# EAGLE design Rev 1 (EAGLE 5.11)
MF: PANASONIC; MPN: EEEFK1E101P; OC_FARNELL: 9695770
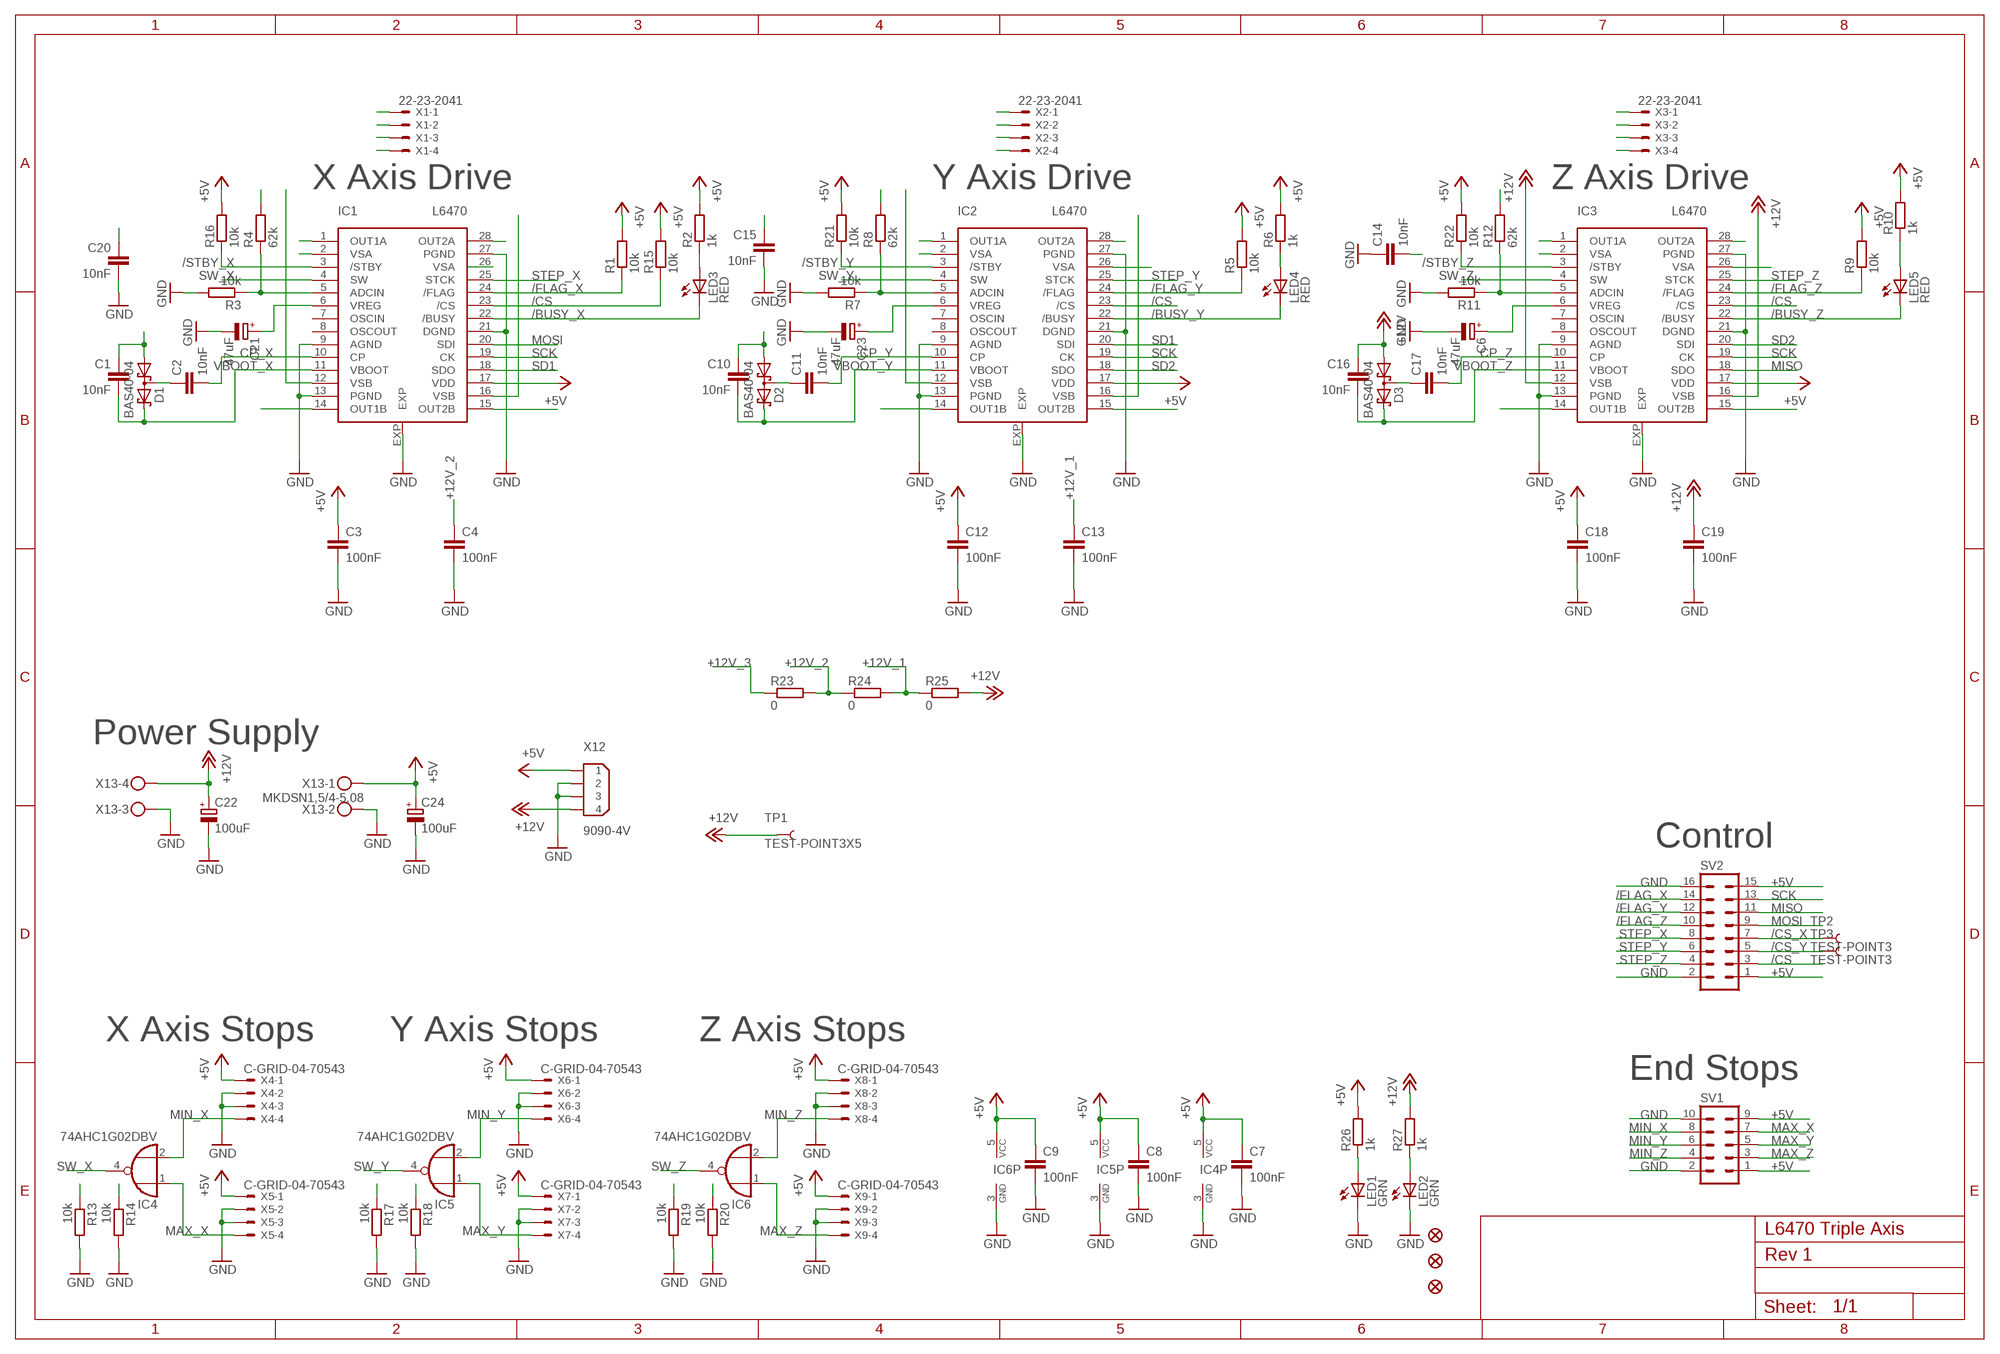
[diagram p0: schematic, sheet 1]

## Parts
C1  10nF  C-EUC0603  [C0603]
C2  10nF  C-EUC0603  [C0603]
C3  100nF  C-EUC0603  [C0603]
C4  100nF  C-EUC0603  [C0603]
C6  47uF  CPOL-EUB  [PANASONIC_B]
C7  100nF  C-EUC0603  [C0603]
C8  100nF  C-EUC0603  [C0603]
C9  100nF  C-EUC0603  [C0603]
C10  10nF  C-EUC0603  [C0603]
C11  10nF  C-EUC0603  [C0603]
C12  100nF  C-EUC0603  [C0603]
C13  100nF  C-EUC0603  [C0603]
C14  10nF  C-EUC0603  [C0603]
C15  10nF  C-EUC0603  [C0603]
C16  10nF  C-EUC0603  [C0603]
C17  10nF  C-EUC0603  [C0603]
C18  100nF  C-EUC0603  [C0603]
C19  100nF  C-EUC0603  [C0603]
C20  10nF  C-EUC0603  [C0603]
C21  47uF  CPOL-EUB  [PANASONIC_B]
C22  100uF  CPOL-EUE  [PANASONIC_E]
C23  47uF  CPOL-EUB  [PANASONIC_B]
C24  100uF  CPOL-EUE  [PANASONIC_E]
D1  BAS40-04  [SOT23]
D2  BAS40-04  [SOT23]
D3  BAS40-04  [SOT23]
FID1  FIDUCIAL1X2.5  [FIDUCIAL-1X2.5]
FID2  FIDUCIAL1X2.5  [FIDUCIAL-1X2.5]
FID3  FIDUCIAL1X2.5  [FIDUCIAL-1X2.5]
IC1  L6470  [TSSOP28]
IC2  L6470  [TSSOP28]
IC3  L6470  [TSSOP28]
IC4  74AHC1G02DBV  [SOT23-5]
IC5  74AHC1G02DBV  [SOT23-5]
IC6  74AHC1G02DBV  [SOT23-5]
LED1  GRN  LEDCHIP-LED0603  [CHIP-LED0603]
LED2  GRN  LEDCHIP-LED0603  [CHIP-LED0603]
LED3  RED  LEDCHIP-LED0603  [CHIP-LED0603]
LED4  RED  LEDCHIP-LED0603  [CHIP-LED0603]
LED5  RED  LEDCHIP-LED0603  [CHIP-LED0603]
R1  10k  R-EU_R0603  [R0603]
R2  1k  R-EU_R0603  [R0603]
R3  10k  R-EU_R0603  [R0603]
R4  62k  R-EU_R0603  [R0603]
R5  10k  R-EU_R0603  [R0603]
R6  1k  R-EU_R0603  [R0603]
R7  10k  R-EU_R0603  [R0603]
R8  62k  R-EU_R0603  [R0603]
R9  10k  R-EU_R0603  [R0603]
R10  1k  R-EU_R0603  [R0603]
R11  10k  R-EU_R0603  [R0603]
R12  62k  R-EU_R0603  [R0603]
R13  10k  R-EU_R0603  [R0603]
R14  10k  R-EU_R0603  [R0603]
R15  10k  R-EU_R0603  [R0603]
R16  10k  R-EU_R0603  [R0603]
R17  10k  R-EU_R0603  [R0603]
R18  10k  R-EU_R0603  [R0603]
R19  10k  R-EU_R0603  [R0603]
R20  10k  R-EU_R0603  [R0603]
R21  10k  R-EU_R0603  [R0603]
R22  10k  R-EU_R0603  [R0603]
R23  0  R-EU_0204/7  [0204/7]
R24  0  R-EU_0204/7  [0204/7]
R25  0  R-EU_0204/7  [0204/7]
R26  1k  R-EU_R0603  [R0603]
R27  1k  R-EU_R0603  [R0603]
SV1  ML10  [ML10]
SV2  ML16  [ML16]
TP1  TEST-POINT3X5  [PAD.03X.05]
TP2  TEST-POINT3  [PAD.03X.03]
TP3  TEST-POINT3  [PAD.03X.03]
X1  22-23-2041  [22-23-2041]
X2  22-23-2041  [22-23-2041]
X3  22-23-2041  [22-23-2041]
X4  C-GRID-04-70543  [70543-04]
X5  C-GRID-04-70543  [70543-04]
X6  C-GRID-04-70543  [70543-04]
X7  C-GRID-04-70543  [70543-04]
X8  C-GRID-04-70543  [70543-04]
X9  C-GRID-04-70543  [70543-04]
X12  9090-4V  [9090-4V]
X13  MKDSN1,5/4-5,08  [MKDSN1,5/4-5,08]

## Nets
+5V [5_V]: C3.1 C7.1 C8.1 C9.1 C12.1 C18.1 C24.+ IC1.17(VDD) IC2.17(VDD) IC3.17(VDD) IC4.5(VCC) IC5.5(VCC) IC6.5(VCC) R1.2 R2.2 R5.2 R6.2 R9.2 R10.2 R15.2 R16.2 R21.2 R22.2 R26.2 SV1.1 SV1.9 SV2.1 SV2.15 X4.1 X5.1 X6.1 X7.1 X8.1 X9.1 X12.1 X13.1
+12V [12_V]: C16.1 C19.1 C22.+ D3.1(A1) IC3.12(VSB) IC3.16(VSB) R25.2 R27.2 TP1.P$1 X12.4 X13.4
+12V_1 [12_V]: C10.1 C13.1 D2.1(A1) IC2.12(VSB) IC2.16(VSB) IC3.2(VSA) IC3.26(VSA) R12.2 R24.2 R25.1
+12V_2: C1.1 C4.1 D1.1(A1) IC1.12(VSB) IC1.16(VSB) IC2.2(VSA) IC2.26(VSA) R8.2 R23.2 R24.1
+12V_3: IC1.2(VSA) IC1.26(VSA) R4.2 R23.1
/BUSY_X: IC1.22(/BUSY) LED3.C
/BUSY_Y: IC2.22(/BUSY) LED4.C
/BUSY_Z: IC3.22(/BUSY) LED5.C
/CS: IC1.23(/CS) IC2.23(/CS) IC3.23(/CS) R15.1 SV2.3
/CS_X: SV2.7 TP2.P$1
/CS_Y: SV2.5 TP3.P$1
/FLAG_X: IC1.24(/FLAG) R1.1 SV2.14
/FLAG_Y: IC2.24(/FLAG) R5.1 SV2.12
/FLAG_Z: IC3.24(/FLAG) R9.1 SV2.10
/STBY_X: IC1.3(/STBY) R16.1
/STBY_Y: IC2.3(/STBY) R21.1
/STBY_Z: IC3.3(/STBY) R22.1
ADC_X: C20.1 IC1.5(ADCIN) R3.1 R4.1
ADC_Y: C15.1 IC2.5(ADCIN) R7.1 R8.1
ADC_Z: C14.2 IC3.5(ADCIN) R11.1 R12.1
CP_X: C2.2 IC1.10(CP)
CP_Y: C11.2 IC2.10(CP)
CP_Z: C17.2 IC3.10(CP)
GND: C3.2 C4.2 C6.- C7.2 C8.2 C9.2 C12.2 C13.2 C14.1 C15.2 C18.2 C19.2 C20.2 C21.- C22.- C23.- C24.- IC1.9(AGND) IC1.13(PGND) IC1.21(DGND) IC1.27(PGND) IC1.EXP IC2.9(AGND) IC2.13(PGND) IC2.21(DGND) IC2.27(PGND) IC2.EXP IC3.9(AGND) IC3.13(PGND) IC3.21(DGND) IC3.27(PGND) IC3.EXP IC4.3(GND) IC5.3(GND) IC6.3(GND) LED1.C LED2.C R3.2 R7.2 R11.2 R13.2 R14.2 R17.2 R18.2 R19.2 R20.2 SV1.2 SV1.10 SV2.2 SV2.16 X4.2 X4.3 X5.2 X5.3 X6.2 X6.3 X7.2 X7.3 X8.2 X8.3 X9.2 X9.3 X12.2 X12.3 X13.2 X13.3
MAX_X: IC4.1(I0) R14.1 SV1.7 X5.4
MAX_Y: IC5.1(I0) R18.1 SV1.5 X7.4
MAX_Z: IC6.1(I0) R20.1 SV1.3 X9.4
MIN_X: IC4.2(I1) R13.1 SV1.8 X4.4
MIN_Y: IC5.2(I1) R17.1 SV1.6 X6.4
MIN_Z: IC6.2(I1) R19.1 SV1.4 X8.4
MISO: IC3.18(SDO) SV2.11
MOSI: IC1.20(SDI) SV2.9
N$1: C17.1 D3.3(C1A2)
N$3: C2.1 D1.3(C1A2)
N$4: IC3.1(OUT1A) X3.4
N$5: IC3.28(OUT2A) X3.3
N$6: IC3.15(OUT2B) X3.2
N$7: IC3.14(OUT1B) X3.1
N$8 [12_V]: IC1.15(OUT2B) X1.2
N$10: C21.+ IC1.6(VREG)
N$11 [12_V]: IC1.1(OUT1A) X1.4
N$12 [12_V]: IC1.28(OUT2A) X1.3
N$13 [12_V]: IC2.28(OUT2A) X2.3
N$14 [12_V]: IC2.1(OUT1A) X2.4
N$15: C11.1 D2.3(C1A2)
N$17: LED1.A R26.1
N$18: LED2.A R27.1
N$19 [12_V]: IC2.15(OUT2B) X2.2
N$20 [12_V]: IC2.14(OUT1B) X2.1
N$22: LED3.A R2.1
N$23: LED4.A R6.1
N$25 [12_V]: IC1.14(OUT1B) X1.1
N$26: LED5.A R10.1
N$27: C6.+ IC3.6(VREG)
N$29: C23.+ IC2.6(VREG)
SCK: IC1.19(CK) IC2.19(CK) IC3.19(CK) SV2.13
SD1: IC1.18(SDO) IC2.20(SDI)
SD2: IC2.18(SDO) IC3.20(SDI)
STEP_X: IC1.25(STCK) SV2.8
STEP_Y: IC2.25(STCK) SV2.6
STEP_Z: IC3.25(STCK) SV2.4
SW_X: IC1.4(SW) IC4.4(O)
SW_Y: IC2.4(SW) IC5.4(O)
SW_Z: IC3.4(SW) IC6.4(O)
VBOOT_X: C1.2 D1.2(C2) IC1.11(VBOOT)
VBOOT_Y: C10.2 D2.2(C2) IC2.11(VBOOT)
VBOOT_Z: C16.2 D3.2(C2) IC3.11(VBOOT)
Unconnected: IC1.7(OSCIN) IC1.8(OSCOUT) IC2.7(OSCIN) IC2.8(OSCOUT) IC3.7(OSCIN) IC3.8(OSCOUT)

## Notes on the sheet
- X Axis Drive | Y Axis Drive | Z Axis Drive
- Power Supply
- Control
- X Axis Stops | Y Axis Stops | Z Axis Stops
- End Stops
- L6470 Triple Axis

## Library data of the parts
C1-C4 C7-C20 = rcl:C-EU: CAPACITOR, European symbol
C6 C21-C24 = rcl:CPOL-EU: POLARIZED CAPACITOR, European symbol
D1-D3 = diode:BAS40-04: Silicon Schottky Diodes General-purpose diode for high-speed switching
FID1-FID3 = microbuilder:FIDUCIAL: Fiducial Alignment Points Various fiducial points for machine vision alignment.
IC1-IC3 = general:L6470: The L6470, realized in analog mixed signal technology, is an advanced fully integrated solution suitable for driving two phase bipolar stepper motors with microstepping. It integrates a dual low RDSon DMOS full bridge with all of the power switches equipped with an accurate on chip current sensing circuitry suitable for non dissipative current control and overcurrent protections. Thanks to a unique control system a true 1/128 steps resolution is achieved. The digital control core can generate user defined motion profiles with acceleration, deceleration, speed or target position easily programmed through a dedicated registers set. All commands and data registers, including those used to set analogue values (i.e. current control value, current protection trip point, dead time, PWM frequency etc.) are sent through a standard 5Mbit/s SPI. A very rich set of protections (thermal, low bus voltage, overcurrent, motor stall) allows designing a fully protected application, as required by most demanding motor control applications.
IC4-IC6 = 74xx-little-de:74*1G02: 2-input NOR gate
LED1-LED5 = led:LED: LED OSRAM: - CHIPLED LG R971, LG N971, LY N971, LG Q971, LY Q971, LO R971, LY R971 LH N974, LH R974 LS Q976, LO Q976, LY Q976 LO Q996 - Hyper CHIPLED LW Q18S LB Q993, LB Q99A, LB R99A - SideLED LS A670, LO A670, LY A670, LG A670, LP A670 LB A673, LV A673, LT A673, LW A673 LH A674 LY A675 LS A676, LA A676, LO A676, LY A676, LW A676 LS A679, LY A679, LG A679 - Hyper Micro SIDELED® LS Y876, LA Y876, LO Y876, LY Y876 LT Y87S - SmartLED LW L88C, LW L88S LB L89C, LB L89S, LG L890 LS L89K, LO L89K, LY L89K LS L896, LA L896, LO L896, LY L896 - TOPLED LS T670, LO T670, LY T670, LG T670, LP T670 LSG T670, LSP T670, LSY T670, LOP T670, LYG T670 LG T671, LOG T671, LSG T671 LB T673, LV T673, LT T673, LW T673 LH T674 LS T676, LA T676, LO T676, LY T676, LB T676, LH T676, LSB T676, LW T676 LB T67C, LV T67C, LT T67C, LS T67K, LO T67K, LY T67K, LW E67C LS E67B, LA E67B, LO E67B, LY E67B, LB E67C, LV E67C, LT E67C LW T67C LS T679, LY T679, LG T679 LS T770, LO T770, LY T770, LG T770, LP T770 LB T773, LV T773, LT T773, LW T773 LH T774 LS E675, LA E675, LY E675, LS T675 LS T776, LA T776, LO T776, LY T776, LB T776 LHGB T686 LT T68C, LB T68C - Hyper Mini TOPLED® LB M676 - Mini TOPLED Santana® LG M470 LS M47K, LO M47K, LY M47K Source: http://www.osram.convergy.de LUXEON: - LUMILED® LXK2-PW12-R00, LXK2-PW12-S00, LXK2-PW14-U00, LXK2-PW14-V00 LXK2-PM12-R00, LXK2-PM12-S00, LXK2-PM14-U00 LXK2-PE12-Q00, LXK2-PE12-R00, LXK2-PE12-S00, LXK2-PE14-T00, LXK2-PE14-U00 LXK2-PB12-K00, LXK2-PB12-L00, LXK2-PB12-M00, LXK2-PB14-N00, LXK2-PB14-P00, LXK2-PB14-Q00 LXK2-PR12-L00, LXK2-PR12-M00, LXK2-PR14-Q00, LXK2-PR14-R00 LXK2-PD12-Q00, LXK2-PD12-R00, LXK2-PD12-S00 LXK2-PH12-R00, LXK2-PH12-S00 LXK2-PL12-P00, LXK2-PL12-Q00, LXK2-PL12-R00 Source: www.luxeon.com KINGBRIGHT: KA-3528ASYC Source: www.kingbright.com
R1-R27 = rcl:R-EU_: RESISTOR, European symbol
SV1 = con-harting-ml:ML10: HARTING
SV2 = con-ml:ML16: HARTING
TP1-TP3 = SparkFun:TEST-POINT
X1-X3 = con-molex:22-23-2041: .100" (2.54mm) Center Header - 4 Pin
X4-X9 = con-molex:C-GRID-04: CONNECTOR wire to board 2.54 mm (0.100") pitch header
X12 = con-thomas-betts:9090-4: Disk Drive Power four position Source: Thomas & Betts Electronic Interconnects Eiropean Edition 1998
X13 = con-phoenix-508:MKDSN1,5/4-5,08: MKDSN 1,5/ 4-5,08 Printklemme Nennstrom: 13,5 A Nennspannung: 250 V Rastermaß: 5,08 mm Polzahl: 4 Anschlussart: Schraubanschluss Montage: Löten Anschlussrichtung Leiter/Platine: 0 ° Artikelnummer: 1729144 Source: http://eshop.phoenixcontact.com .. 1729144.pdf

## Net classes
0 default: drill 0.33 mm, clearance 0.203 mm
1 12_V: width 0.406 mm, drill 0.33 mm, clearance 0.203 mm
2 5_V: width 0.305 mm, drill 0.33 mm, clearance 0.203 mm

## Board
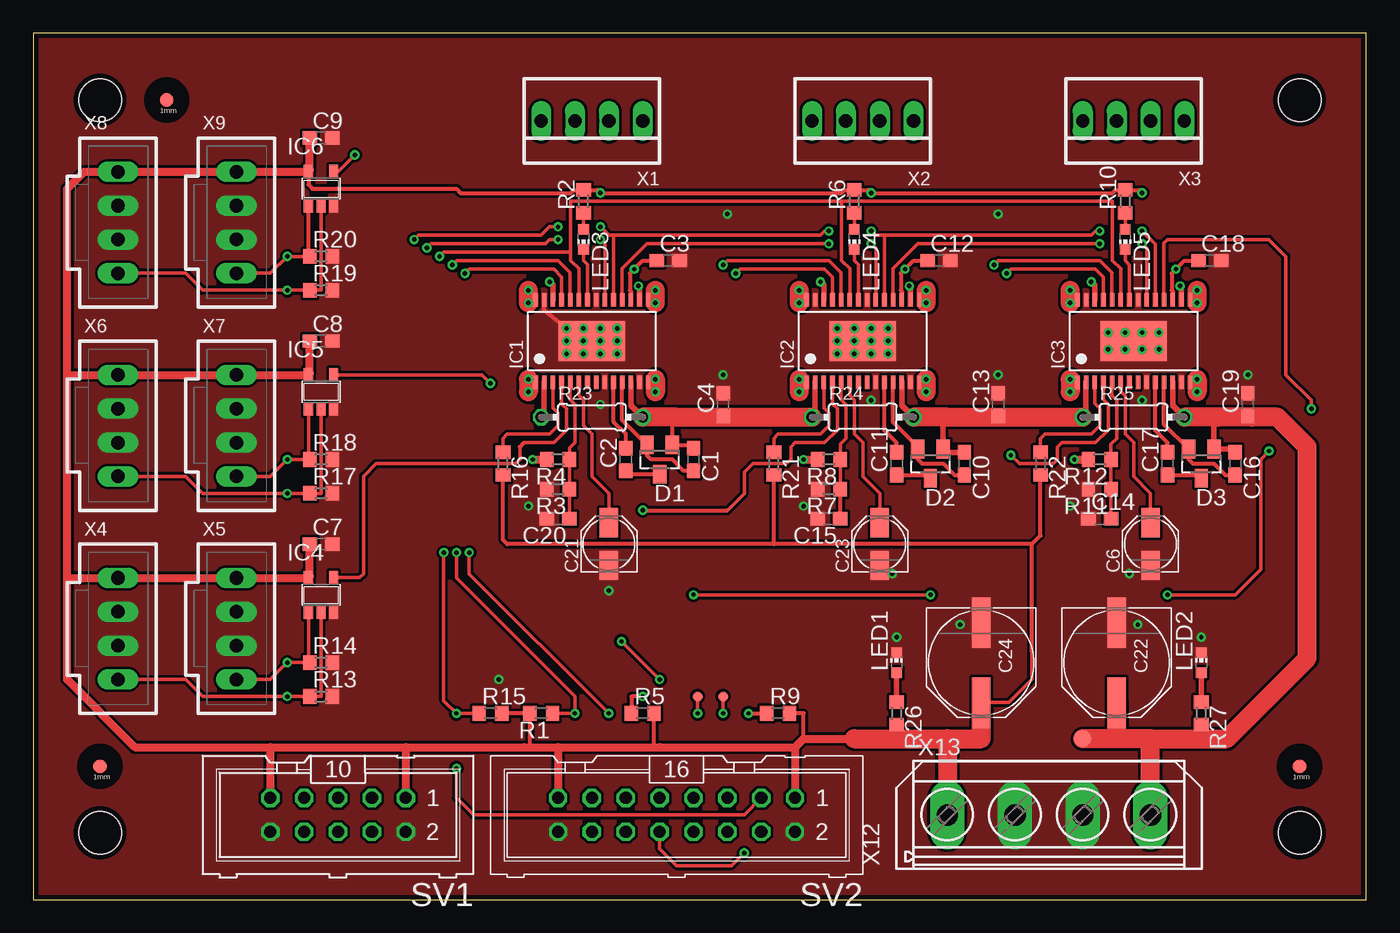
[diagram p1: board, top side]
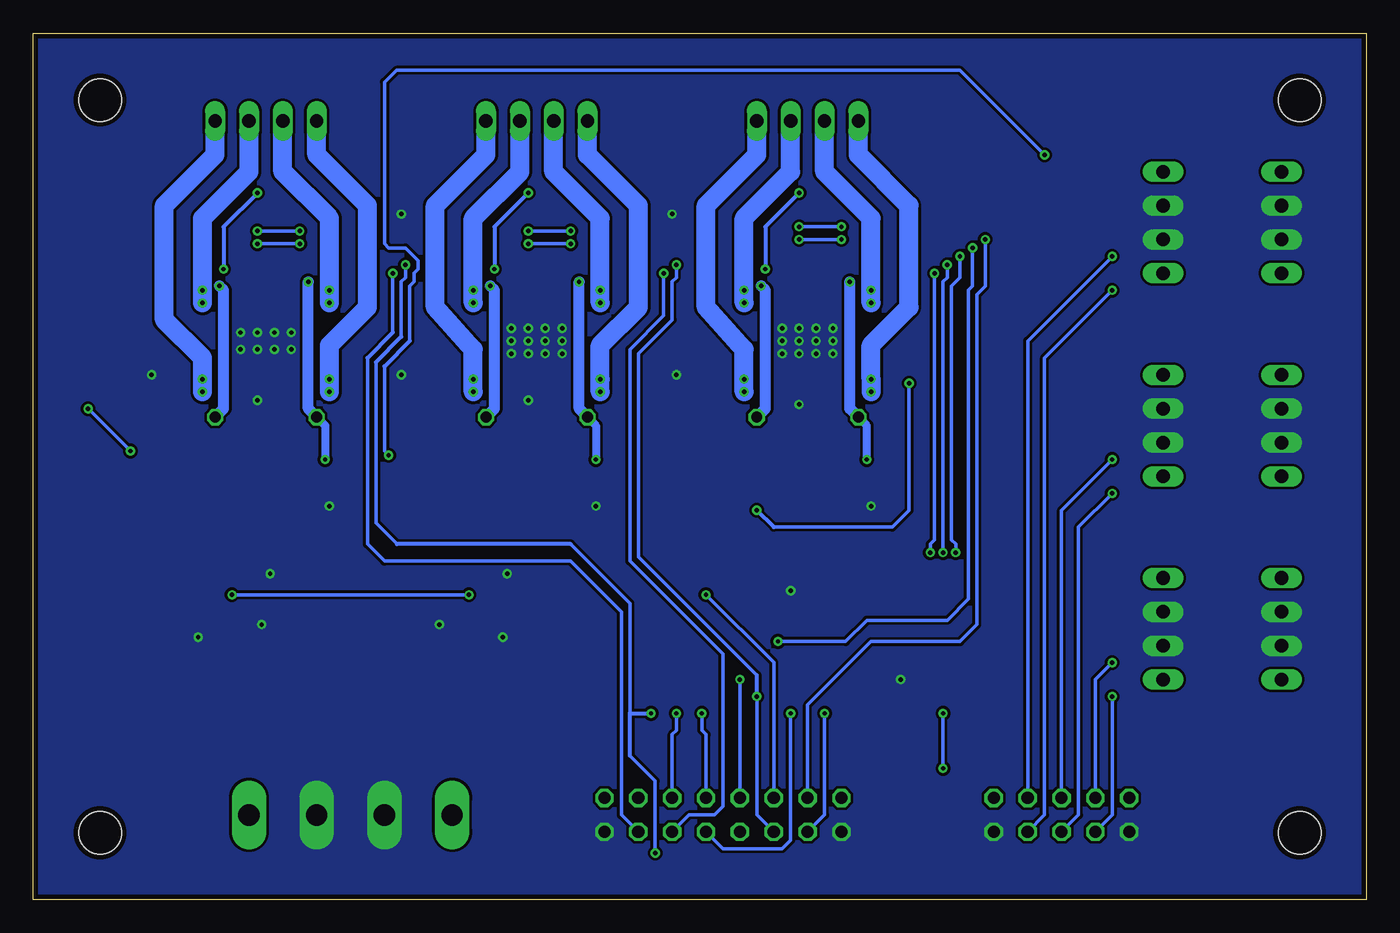
[diagram p2: board, bottom side, seen from below]

Size 100 x 65 mm. Coordinates in mm from the lower left corner, seen from the top.
Outline: 0,0 100,0 100,65 0,65 0,0
Copper layers (1*16): Top 0.0356mm / dielectric 1.5011mm / Bottom 0.0356mm
Design rules "LaenPCBOrder": minimum track width 6mil, minimum drill 13mil, track to track 6mil, track to pad 6mil, pad to pad 6mil, via to via 6mil, smd to smd 6mil, copper to edge 15mil, drill to drill 6mil, minimum pad ring 7mil, minimum via ring 7mil, stop-mask expansion 4mil, vias tented up to drill 0mil, thermal gap 10mil
Holes 3.2 mm at 5,60 5,5 95,5 95,60

### Footprints (pad centres in the part's own frame; a part is rotated, then mirrored left to right if it is on the bottom)
C0603 = smd 1.1 x 1: 1 -0.85,0; 2 0.85,0
PANASONIC_B = smd 2.2 x 1.4: + 1.6,0; - -1.6,0
PANASONIC_E = smd 3.8 x 1.4: + 3,0; - -3,0
SOT23 = smd 1 x 1.4: 1 -0.95,-1.1; 2 0.95,-1.1; 3 0,1.1
FIDUCIAL-1X2.5 = smd 1 x 1: 1 0,0
TSSOP28 = smd 0.35 x 1: 1 -4.225,-3.087; 2 -3.575,-3.087; 3 -2.925,-3.087; 4 -2.275,-3.087; 5 -1.625,-3.087; 6 -0.975,-3.087; 7 -0.325,-3.087; 8 0.325,-3.087; 9 0.975,-3.087; 10 1.625,-3.087; 11 2.275,-3.087; 12 2.925,-3.087; 13 3.575,-3.087; 14 4.225,-3.087; 15 4.225,3.087; 16 3.575,3.087; 17 2.925,3.087; 18 2.275,3.087; 19 1.625,3.087; 20 0.975,3.087; 21 0.325,3.087; 22 -0.325,3.087; 23 -0.975,3.087; 24 -1.625,3.087; 25 -2.275,3.087; 26 -2.925,3.087; 27 -3.575,3.087; 28 -4.225,3.087 | smd 5 x 3: EXP 0,0
SOT23-5 = smd 0.69 x 0.99: 1 -0.95,-1.29; 2 0,-1.29; 3 0.95,-1.29; 4 0.95,1.3; 5 -0.95,1.3
CHIP-LED0603 = smd 0.8 x 0.8: A 0,-0.75; C 0,0.75
R0603 = smd 1 x 1.1: 1 -0.85,0; 2 0.85,0
0204/7 = drill 0.813 octagon: 1 -3.81,0; 2 3.81,0
ML10 = drill 0.914 octagon: 1 -5.08,-1.27; 2 -5.08,1.27; 3 -2.54,-1.27; 4 -2.54,1.27; 5 0,-1.27; 6 0,1.27; 7 2.54,-1.27; 8 2.54,1.27; 9 5.08,-1.27; 10 5.08,1.27
ML16 = drill 0.914 octagon: 1 -8.89,-1.27; 2 -8.89,1.27; 3 -6.35,-1.27; 4 -6.35,1.27; 5 -3.81,-1.27; 6 -3.81,1.27; 7 -1.27,-1.27; 8 -1.27,1.27; 9 1.27,-1.27; 10 1.27,1.27; 11 3.81,-1.27; 12 3.81,1.27; 13 6.35,-1.27; 14 6.35,1.27; 15 8.89,-1.27; 16 8.89,1.27
PAD.03X.05 = smd 1.27 x 1.27: P$1 0,0
PAD.03X.03 = smd 0.762 x 0.762: P$1 0,0
22-23-2041 = drill 1 long: 1 -3.81,0; 2 -1.27,0; 3 1.27,0; 4 3.81,0
70543-04 = drill 1.016 long: 1 -3.81,0; 2 -1.27,0; 3 1.27,0; 4 3.81,0
9090-4V = drill 1.6 pad 2.6 long: 1 -7.62,0; 2 -2.54,0; 3 2.54,0; 4 7.62,0
MKDSN1,5/4-5,08 = drill 1.3 pad 2 round: 1 -7.641,0.025; 2 -2.561,0.025; 3 2.519,0.025; 4 7.599,0.025

### Placement (x,y rotation side)
C1  49.53,33.02 270 top
C2  44.45,33.02 90 top
C3  47.62,47.94 0 top
C4  51.75,37.15 90 top
C6  83.82,26.67 90 top
C7  21.59,26.67 0 top
C8  21.59,41.91 0 top
C9  21.59,57.15 0 top
C10  69.85,32.7 270 top
C11  64.77,32.7 90 top
C12  67.94,47.94 0 top
C13  72.39,37.15 90 top
C14  80.01,28.57 0 top
C15  59.69,28.57 180 top
C16  90.17,32.7 270 top
C17  85.09,32.7 90 top
C18  88.27,47.94 0 top
C19  91.12,37.15 90 top
C20  39.37,28.57 180 top
C21  43.18,26.67 90 top
C22  81.28,17.78 270 top
C23  63.5,26.67 90 top
C24  71.12,17.78 270 top
D1  46.99,33.02 180 top
D2  67.31,32.7 180 top
D3  87.63,32.7 180 top
FID1  5,10 0 top
FID2  95,10 0 top
FID3  10,60 0 top
IC1  41.91,41.91 0 top
IC2  62.23,41.91 0 top
IC3  82.55,41.91 0 top
IC4  21.59,22.86 0 top
IC5  21.59,38.1 0 top
IC6  21.59,53.34 0 top
LED1  64.77,17.78 0 top
LED2  87.63,17.78 0 top
LED3  41.27,49.53 180 top
LED4  61.59,49.53 180 top
LED5  81.92,49.53 180 top
R1  38.1,13.97 180 top
R2  41.27,52.39 90 top
R3  39.37,30.8 180 top
R4  39.37,33.02 180 top
R5  45.72,13.97 0 top
R6  61.59,52.39 90 top
R7  59.69,30.8 180 top
R8  59.69,33.02 180 top
R9  55.88,13.97 0 top
R10  81.92,52.39 90 top
R11  80.01,30.8 180 top
R12  80.01,33.02 180 top
R13  21.59,15.24 0 top
R14  21.59,17.78 0 top
R15  34.29,13.97 0 top
R16  35.24,32.7 270 top
R17  21.59,30.48 0 top
R18  21.59,33.02 0 top
R19  21.59,45.72 0 top
R20  21.59,48.26 0 top
R21  55.56,32.7 270 top
R22  75.56,32.7 270 top
R23  41.91,36.2 0 top
R24  62.23,36.2 0 top
R25  82.55,36.2 0 top
R26  64.77,13.97 270 top
R27  87.63,13.97 270 top
SV1  22.86,6.35 180 top
SV2  48.26,6.35 180 top
TP1  78.74,12.06 0 top
TP2  49.85,15.24 0 top
TP3  51.75,15.24 90 top
X1  41.91,58.42 180 top
X2  62.23,58.42 180 top
X3  82.55,58.42 180 top
X4  6.35,20.32 270 top
X5  15.24,20.32 270 top
X6  6.35,35.56 270 top
X7  15.24,35.56 270 top
X8  6.35,50.8 270 top
X9  15.24,50.8 270 top
X12  76.2,6.35 0 top
X13  76.2,6.35 0 top

### Tracks (layer width: path | path; a pad name or v marks a point on that pad's centre or on a via)
+5V  (via drill 0.33)
  Top 0: X12.1 X13.1
  Top 0.254: C24.+ 73.2,14.78 74.93,16.51 74.93,18.59
  Top 0.305: 20.61,24.13 IC4.5 20.74,24.26 | 20.61,39.37 IC5.5 20.74,39.5 | 20.61,54.61 IC6.5 | IC6.5 20.74,54.74 | R16.2 35.24,26.99 35.56,26.67 55.56,26.67 | 55.56,26.67 R21.2 | R22.2 75.56,27.3 74.93,26.67 | 74.93,26.67 55.56,26.67 | IC1.17 44.84,45.65 44.77,45.72 44.77,46.99 v45.09,47.31 45.72,47.94 C3.1 | IC2.17 65.16,45.65 65.09,45.72 65.09,46.99 v65.41,47.31 66.04,47.94 C12.1 | IC3.17 85.47,45.65 85.41,45.72 85.41,46.99 v85.72,47.31 86.36,47.94 C18.1 | 74.93,18.59 74.93,26.67 | 36.83,11.43 37.25,11.43 R1.2 R15.2 | R5.2 46.57,11.43 46.99,11.43 | R9.2 57.78,13.97 57.78,12.06 | v83.19,53.02 82.97,53.24 R10.2 81.18,53.24 80.96,53.02 v62.87,53.02 62.65,53.24 R6.2 60.86,53.24 60.64,53.02 v42.55,53.02 42.33,53.24 R2.2 40.54,53.24 40.32,53.02 32.07,53.02 31.75,53.34 20.95,53.34 20.64,53.66 IC6.5
  Top 0.406: 68.58,6.4 X13.1
  Top 0.61: 2.54,24.13 2.54,39.37 | 2.54,39.37 2.54,53.34 3.81,54.61 X8.1 X9.1 20.61,54.61 | 2.54,24.13 X4.1 X5.1 20.61,24.13 | 2.54,39.37 X6.1 X7.1 20.61,39.37 | 2.54,24.13 2.54,16.51 7.62,11.43 17.78,11.43 | 17.78,11.43 SV1.9 | 17.78,11.43 27.94,11.43 | 27.94,11.43 36.83,11.43 39.37,11.43 | 39.37,11.43 46.99,11.43 57.15,11.43 | 27.94,11.43 SV1.1 | 20.74,39.5 C8.1 | 20.74,24.26 C7.1 | 20.74,54.74 C9.1 | 57.15,11.43 SV2.1 | 61.59,12.06 57.78,12.06 57.15,11.43 | 39.37,11.43 SV2.15
  Top 0.813: 64.77,12.06 R26.2
  Top 1.422: C24.+ 71.12,12.06 68.58,12.06 | 68.58,12.06 68.58,6.4 | 61.59,12.06 64.77,12.06 68.58,12.06
  Bottom 0.305: v45.09,47.31 45.09,50.48 v42.55,53.02 | v65.41,47.31 65.41,50.48 v62.87,53.02 | v85.72,47.31 85.72,50.48 v83.19,53.02
+12V  (via drill 0.33)
  Top 0.305: C19.1 91.34,36.3 91.44,36.2
  Top 0.406: IC3.16 86.12,45.95 v86.04,46.04 | 88.9,36.2 88.58,35.88 D3.1 89.92,33.8 C16.1 | IC3.12 85.47,37.08 R25.2 | X12.4 X13.4
  Top 0.813: 87.63,12.06 R27.2
  Top 1.422: R25.2 88.9,36.2 91.44,36.2 93.34,36.2 95.57,33.97 95.57,18.1 89.53,12.06 87.63,12.06 83.82,12.06 | X12.4 83.82,12.06 | 83.82,12.06 81.28,12.06 | 81.28,12.06 C22.+ | 81.28,12.06 TP1.P$1
  Bottom 0.813: v86.04,46.04 85.72,45.72 85.72,36.83 R25.2
+12V_1  (via drill 0.33)
  Top 0.305: 72.39,36.2 C13.1
  Top 0.406: IC2.16 65.81,45.95 v65.72,46.04 | IC3.26 79.62,46.1 v79.38,46.35 | IC3.2 78.97,36.43 R25.1 | IC2.12 65.16,37.08 R24.2 | C10.1 68.51,33.55 D2.1 68.26,35.88 68.58,36.2
  Top 0.61: v78.11,33.02 R12.2
  Top 1.422: R24.2 68.58,36.2 72.39,36.2 R25.1
  Bottom 0.61: R25.1 78.11,35.56 v78.11,33.02
  Bottom 0.813: v79.38,46.35 79.38,36.83 R25.1 | v65.72,46.04 65.41,45.72 65.41,36.83 R24.2
+12V_2  (via drill 0.33)
  Top 0.305: D1.1 49.6,34.12 | 47.94,34.61 47.94,36.2 48.26,36.2 | C4.1 50.7,36.3 50.8,36.2
  Top 0.406: IC2.2 58.66,36.43 R24.1 | v59.05,46.35 59.3,46.1 IC2.26 | IC1.16 45.48,45.95 v45.4,46.04 | IC1.12 44.84,37.08 R23.2 | D1.1 47.94,34.61 | 49.6,34.12 C1.1
  Top 0.61: v57.78,33.02 R8.2
  Top 1.422: R23.2 48.26,36.2 50.8,36.2 R24.1
  Bottom 0.61: R24.1 57.78,35.56 v57.78,33.02
  Bottom 0.813: R24.1 59.05,36.83 v59.05,46.35 | v45.4,46.04 45.09,45.72 45.09,36.83 R23.2
+12V_3  (via drill 0.33)
  Top 0.406: IC1.2 38.34,36.43 R23.1 | IC1.26 38.98,46.1 v38.73,46.35
  Top 0.61: v37.47,33.02 R4.2
  Bottom 0.61: R23.1 37.47,35.56 v37.47,33.02
  Bottom 0.813: v38.73,46.35 38.73,36.83 R23.1
/BUSY_X
  Top 0.254: IC1.22 41.59,47.63 41.27,47.94 LED3.C
/BUSY_Y
  Top 0.254: IC2.22 61.91,47.63 61.59,47.94 LED4.C
/BUSY_Z
  Top 0.254: IC3.22 82.22,47.62 81.92,47.94 LED5.C
/CS  (via drill 0.33)
  Top 0.254: IC1.23 40.94,47.33 40.32,47.94 40.32,48.58 | 40.32,48.58 40.32,52.39 60.64,52.39 | IC2.23 61.26,47.33 60.64,47.94 60.64,52.39 | IC3.23 81.58,47.33 80.96,47.94 80.96,52.39 60.64,52.39 | v30.48,48.26 30.8,48.58 40.32,48.58 | SV2.3 53.34,6.35 33.02,6.35 31.75,7.62 v31.75,9.84 | R15.1 v31.75,13.97 30.8,14.92 v30.8,26.04
  Bottom 0.254: v30.48,48.26 30.48,46.67 31.11,46.04 31.11,26.99 30.8,26.67 v30.8,26.04 | v31.75,9.84 v31.75,13.97
/CS_X  (via drill 0.33)
  Top 0.254: v49.85,13.97 TP2.P$1
  Bottom 0.254: SV2.7 49.53,12.38 49.85,12.7 v49.85,13.97
/CS_Y  (via drill 0.33)
  Top 0.254: v51.75,13.97 TP3.P$1
  Bottom 0.254: SV2.5 52.07,12.38 51.75,12.7 v51.75,13.97
/FLAG_X  (via drill 0.33)
  Top 0.254: IC1.24 40.28,47.03 39.37,47.94 31.75,47.94 v31.43,47.62 | R1.1 v40.64,13.97 40.64,15.24 31.75,24.13 v31.75,26.04
  Bottom 0.254: SV2.14 40.64,6.35 v40.64,13.97 | v31.43,47.62 31.43,46.67 31.75,46.35 v31.75,26.04
/FLAG_Y  (via drill 0.33)
  Top 0.254: IC2.24 60.6,47.03 59.69,47.94 52.07,47.94 v51.75,47.62
  Top 0.305: R5.1 44.87,15.24 v45.72,15.24
  Bottom 0.254: SV2.12 45.72,6.35 v45.72,15.24 | v51.75,47.62 51.75,46.67 52.07,46.35 52.07,43.5 54.61,40.96 54.61,25.72 45.72,16.83
  Bottom 0.305: v45.72,15.24 45.72,16.83
/FLAG_Z  (via drill 0.33)
  Top 0.254: SV2.10 46.99,3.81 48.26,2.54 52.39,2.54 v53.34,3.49 | IC3.24 80.92,47.03 80.01,47.94 72.39,47.94
  Top 0.305: v72.07,47.62 72.39,47.94 | v53.66,13.97 R9.1
  Bottom 0.254: v72.07,47.62 72.07,46.67 72.39,46.35 72.39,42.23 | 74.3,40.32 74.3,28.26 72.71,26.67 | 59.69,26.67 55.24,22.23 55.24,13.97 | v53.34,3.49 53.34,8.89 55.24,10.79
  Bottom 0.305: 74.3,40.32 72.39,42.23 | 55.24,10.79 55.24,13.97 v53.66,13.97 | 59.69,26.67 72.71,26.67
/STBY_X
  Top 0.254: IC1.3 38.98,36.9 39.37,36.51 39.37,35.56 38.73,34.92 35.56,34.92 35.24,34.61 R16.1
/STBY_Y
  Top 0.254: IC2.3 59.3,36.9 59.69,36.51 59.69,35.56 59.05,34.92 55.88,34.92 55.56,34.61 R21.1
/STBY_Z
  Top 0.254: IC3.3 79.62,37.22 80.01,36.83 80.01,35.56 79.38,34.92 75.88,34.92 75.56,34.61 R22.1
ADC_X
  Top 0.254: IC1.5 40.28,37.5 40.64,37.15 40.64,34.29 40.22,33.87 R4.1 R3.1 C20.1
ADC_Y
  Top 0.254: IC2.5 60.6,37.5 60.96,37.15 60.96,34.61 60.54,34.19 R8.1 R7.1
  Top 0.305: C15.1 R7.1
ADC_Z
  Top 0.254: IC3.5 80.92,37.82 81.28,37.47 81.28,34.61 80.86,34.19 R12.1 R11.1 C14.2
CP_X
  Top 0.305: IC1.10 43.53,35.84 44.45,34.92 C2.2
CP_Y
  Top 0.305: IC2.10 63.85,35.2 64.77,34.29 C11.2
CP_Z
  Top 0.305: IC3.10 84.17,35.2 85.09,34.29 C17.2
GND  (via drill 0.33)
  Top 0.305: IC1.27 38.34,44.22 v40.01,42.86
  other vias: 64.14,42.86 62.87,42.86 60.33,42.86 61.59,42.86 61.59,40.96 62.87,40.96 64.14,40.96 60.33,40.96 41.27,42.86 42.55,42.86 43.81,42.86 42.55,40.96 43.81,40.96 41.27,40.96 40.01,40.96 83.19,41.27 81.92,42.55 83.19,42.55 81.92,41.27 80.64,41.27 80.64,42.55 84.45,41.27 84.45,42.55 42.55,41.91 43.81,41.91 41.27,41.91 40.01,41.91 60.33,41.91 61.59,41.91 62.87,41.91 64.14,41.91 42.55,37.15 51.75,39.37 77.79,29.53 83.19,37.47 72.39,39.37 91.12,39.37 62.87,37.47 57.78,29.53 37.15,29.53 43.18,23.18 64.77,19.68 69.53,20.64 82.87,20.64 87.63,19.68 52.07,51.44 72.39,51.44 34.92,16.51 64.45,24.45 82.23,24.45
  pour Top (no thermals): 0,65 100,65 100,0 0,0
  pour Bottom (no thermals): 0,65 100,65 100,0 0,0
MAX_X  (via drill 0.33)
  Top 0.254: X5.4 17.78,16.51 v19.05,17.78 R14.1 20.64,17.88 IC4.1
  Bottom 0.254: SV1.7 20.32,16.51 v19.05,17.78
MAX_Y  (via drill 0.33)
  Top 0.254: X7.4 17.78,31.75 v19.05,33.02 R18.1 | 20.64,33.12 IC5.1
  Top 0.305: R18.1 20.64,33.12
  Bottom 0.254: SV1.5 22.86,29.21 v19.05,33.02
MAX_Z  (via drill 0.33)
  Top 0.254: X9.4 17.78,46.99 v19.05,48.26 R20.1
  Top 0.305: IC6.1 20.64,48.36 R20.1
  Bottom 0.254: SV1.3 25.4,41.91 v19.05,48.26
MIN_X  (via drill 0.33)
  Top 0.254: X4.4 11.43,16.51 12.7,15.24 v19.05,15.24 R13.1 21.59,15.24 IC4.2
  Bottom 0.254: SV1.8 19.05,6.35 v19.05,15.24
MIN_Y  (via drill 0.33)
  Top 0.254: X6.4 11.43,31.75 12.7,30.48 v19.05,30.48 R17.1 21.59,30.48 IC5.2
  Bottom 0.254: SV1.6 21.59,6.35 21.59,27.94 v19.05,30.48
MIN_Z  (via drill 0.33)
  Top 0.254: X8.4 11.43,46.99 12.7,45.72 v19.05,45.72 R19.1 21.59,45.72 IC6.2
  Bottom 0.254: v19.05,45.72 24.13,40.64 24.13,6.35 SV1.4
MISO  (via drill 0.33)
  Top 0.254: IC3.18 84.83,49.27 85.09,49.53 92.71,49.53 93.98,48.26 93.98,39.37 95.89,37.47 v95.89,36.83 | v92.71,33.66 92.08,33.02 92.08,24.77 90.17,22.86 v85.09,22.86 | v49.53,22.86 v67.31,22.86
  Bottom 0.254: SV2.11 44.45,17.78 v49.53,22.86 | v92.71,33.66 v95.89,36.83 | v67.31,22.86 v85.09,22.86
MOSI  (via drill 0.33)
  Top 0.254: v44.13,19.37 v46.99,16.51 | IC1.20 42.88,49.19 v42.55,49.53 | v39.37,49.53 38.73,49.53 38.42,49.21 29.84,49.21 v29.53,48.9
  Bottom 0.254: v46.99,16.51 SV2.9 | v39.37,49.53 v42.55,49.53 | v29.53,48.9 29.53,46.04 29.84,45.72 29.84,22.54 31.43,20.95 37.47,20.95 39.05,19.37 v44.13,19.37
N$1
  Top 0.305: C17.1 87.38,31.85 D3.3
N$3
  Top 0.305: 44.38,31.92 D1.3
  Top 0.406: C2.1 44.38,31.92
N$4  (via drill 0.33)
  Top 0.305: IC3.1 78.02,38.82 v77.79,39.05
  Top 1.422: v77.79,39.05 v77.79,38.1
  Bottom 1.422: X3.4 78.74,55.88 74.93,52.07 74.93,44.45 77.79,41.59 v77.79,38.1
N$5  (via drill 0.33)
  Top 0.305: IC3.28 78.02,45 v77.79,44.77
  Top 1.422: v77.79,44.77 v77.79,45.72
  Bottom 1.422: X3.3 81.28,54.61 77.79,51.12 v77.79,45.72 v77.79,44.77
N$6  (via drill 0.33)
  Top 0.305: IC3.15 87.08,45 v87.31,44.77
  Top 1.422: v87.31,44.77 v87.31,45.72
  Bottom 1.422: X3.2 83.82,54.61 87.31,51.12 v87.31,45.72 v87.31,44.77
N$7  (via drill 0.33)
  Top 0.305: IC3.14 87.31,38.82 v87.31,39.05
  Top 1.422: v87.31,39.05 v87.31,38.1
  Bottom 1.422: X3.1 86.36,55.88 90.17,52.07 90.17,43.5 87.31,40.64 v87.31,38.1
N$8  (via drill 0.33)
  Top 0.305: IC1.15 46.44,45 v46.67,44.77
  Top 1.422: v46.67,44.77 v46.67,45.72
  Bottom 1.422: X1.2 43.18,54.61 46.67,51.12 v46.67,44.77
N$10
  Top 0.254: IC1.6 40.94,37.8 41.27,37.47 41.27,35.56 41.91,34.92 41.91,31.75 43.18,30.48 C21.+
N$11  (via drill 0.33)
  Top 0.305: IC1.1 37.69,38.83 v37.15,39.05
  Top 1.422: v37.15,39.05 v37.15,38.1
  Bottom 1.422: v37.15,38.1 v37.15,39.05 37.15,41.59 34.29,44.45 34.29,52.07 38.1,55.88 X1.4
N$12  (via drill 0.33)
  Top 0.305: IC1.28 37.38,45 v37.15,44.77
  Top 1.422: v37.15,44.77 v37.15,45.72
  Bottom 1.422: X1.3 40.64,54.61 37.15,51.12 v37.15,44.77
N$13  (via drill 0.33)
  Top 0.305: IC2.28 58.01,44.99 v57.47,44.77
  Top 1.422: v57.47,44.77 v57.47,45.72
  Bottom 1.422: X2.3 60.96,54.61 57.47,51.12 v57.47,44.77
N$14  (via drill 0.33)
  Top 0.305: IC2.1 57.87,38.82 v57.47,38.1
  Top 1.422: v57.47,38.1 v57.47,39.05
  Bottom 1.422: X2.4 58.42,55.88 54.61,52.07 54.61,44.45 57.47,41.59 v57.47,39.05 v57.47,38.1
N$15
  Top 0.305: C11.1 67.06,31.85 D2.3
N$17
  Top 0.406: R26.1 LED1.A
N$18
  Top 0.406: R27.1 LED2.A
N$19  (via drill 0.33)
  Top 0.305: IC2.15 66.45,44.99 v66.99,44.77
  Top 1.422: v66.99,44.77 v66.99,45.72
  Bottom 1.422: X2.2 63.5,54.61 66.99,51.12 v66.99,44.77
N$20  (via drill 0.33)
  Top 0.305: IC2.14 66.59,38.82 v66.99,38.1
  Top 1.422: v66.99,38.1 v66.99,39.05
  Bottom 1.422: X2.1 66.04,55.88 69.85,52.07 69.85,44.45 66.99,41.27 v66.99,38.1
N$22
  Top 0.254: LED3.A R2.1
N$23
  Top 0.254: LED4.A R6.1
N$25  (via drill 0.33)
  Top 0.305: IC1.14 46.44,38.82 v46.67,39.05
  Top 1.422: v46.67,39.05 v46.67,38.1
  Bottom 1.422: X1.1 45.72,55.88 49.53,52.07 49.53,44.45 46.67,41.27 v46.67,38.1
N$26
  Top 0.254: LED5.A R10.1
N$27
  Top 0.254: IC3.6 81.58,38.12 81.92,37.78 81.92,34.92 82.55,34.29 82.55,31.75 83.82,30.48 C6.+
N$29
  Top 0.254: IC2.6 61.26,37.8 61.59,37.47 61.59,34.92 62.23,34.29 62.23,31.75 63.5,30.48 C23.+
SCK  (via drill 0.33)
  Top 0.254: IC3.19 84.17,49.17 v83.19,50.16 | v59.69,50.16 59.37,50.16 59.05,49.85 43.53,49.85 | v80.01,50.16 79.69,50.16 79.38,49.85 63.85,49.85 | 43.53,49.85 IC1.19 | v42.55,50.48 43.18,49.85 43.53,49.85 | v39.37,50.48 38.73,50.48 38.1,49.85 28.89,49.85 v28.57,49.53 | v62.87,50.16 63.18,49.85 63.85,49.85 | 63.85,49.85 IC2.19
  Bottom 0.254: v80.01,50.16 v83.19,50.16 | v59.69,50.16 v62.87,50.16 | v39.37,50.48 v42.55,50.48 | v28.57,49.53 28.57,46.04 29.21,45.4 29.21,20.64 30.48,19.37 37.15,19.37 41.91,14.61 SV2.13
SD1  (via drill 0.33)
  Top 0.254: IC1.18 44.19,47.36 46.04,49.21 v59.69,49.21 | v62.87,49.21 63.2,48.87 IC2.20
  Bottom 0.254: v59.69,49.21 v62.87,49.21
SD2  (via drill 0.33)
  Top 0.254: IC2.18 64.5,47.36 66.36,49.21 v80.01,49.21 | IC3.20 83.53,48.87 v83.19,49.21
  Bottom 0.254: v80.01,49.21 v83.19,49.21
STEP_X  (via drill 0.33)
  Top 0.254: IC1.25 39.63,46.73 39.05,47.31 32.7,47.31 v32.38,46.99 | v32.7,26.04 32.7,24.45 v43.18,13.97
  Bottom 0.254: SV2.8 48.26,3.81 43.81,3.81 43.18,4.45 v43.18,13.97 | v32.7,26.04 32.7,26.67 32.38,26.99 v32.38,46.99
STEP_Y  (via drill 0.33)
  Top 0.254: IC2.25 59.95,46.73 59.37,47.31 53.02,47.31 v52.7,46.99
  Bottom 0.254: SV2.6 50.8,6.35 48.9,6.35 48.26,6.99 48.26,18.41 55.24,25.4 55.24,41.27 52.7,43.81 v52.7,46.99
STEP_Z  (via drill 0.33)
  Top 0.254: IC3.25 80.28,46.73 79.69,47.31 73.34,47.31 v73.03,46.99
  Bottom 0.254: SV2.4 55.88,6.35 55.88,21.59 59.69,25.4 73.66,25.4 74.93,26.67 74.93,40.64 | 73.03,42.55 v73.03,46.99
  Bottom 0.305: 74.93,40.64 73.03,42.55
SW_X
  Top 0.254: IC1.4 39.63,37.2 40.01,36.83 40.01,35.24 39.05,34.29 36.83,34.29 | 36.51,33.97 36.51,33.02 36.2,32.7 33.02,32.7 25.72,32.7 24.77,31.75 24.77,24.45 24.48,24.16 IC4.4
  Top 0.305: 36.51,33.97 36.83,34.29
SW_Y  (via drill 0.33)
  Top 0.254: IC2.4 59.95,37.2 60.33,36.83 60.33,35.24 59.37,34.29 57.15,34.29 56.83,33.97 56.83,33.02 56.52,32.7 53.98,32.7 53.34,32.07 53.34,30.48 52.07,29.21 | v34.29,38.73 33.66,39.37 22.57,39.37
  Top 0.305: v45.72,29.21 52.07,29.21 | IC5.4 22.57,39.37
  Bottom 0.254: v34.29,38.73 34.29,29.21 35.56,27.94 44.45,27.94
  Bottom 0.305: 44.45,27.94 v45.72,29.21
SW_Z  (via drill 0.33)
  Top 0.254: IC6.4 22.89,54.64 v24.13,55.88 | IC3.4 80.28,37.52 80.64,37.15 80.64,35.24 79.69,34.29 77.15,34.29 76.83,33.97 76.83,33.02 76.52,32.7 73.98,32.7 v73.34,33.34
  Bottom 0.254: v73.34,33.34 73.66,33.66 73.66,40.01 | v24.13,55.88 30.48,62.23 72.76,62.23 73.66,61.33 73.66,49.21 73.34,48.9 72.07,48.9 71.12,47.94 71.12,47.31 71.44,46.99 71.44,46.35 71.75,46.04 71.75,41.91
  Bottom 0.305: 71.75,41.91 73.66,40.01
VBOOT_X
  Top 0.305: IC1.11 44.19,35.98 D1.2 46.04,33.34 46.35,33.02 47.94,33.02 48.79,32.17 C1.2
VBOOT_Y
  Top 0.305: IC2.11 64.5,35.83 66.36,33.97 D2.2 | C10.2 69.11,31.85 68.26,32.7 66.67,32.7 66.36,33.02 D2.2 | D2.2
VBOOT_Z
  Top 0.305: C16.2 89.43,31.85 88.58,32.7 87,32.7 86.68,33.02 D3.2 84.83,35.66 IC3.11

### Text on the board
tDocu: L6470 Triple Axis